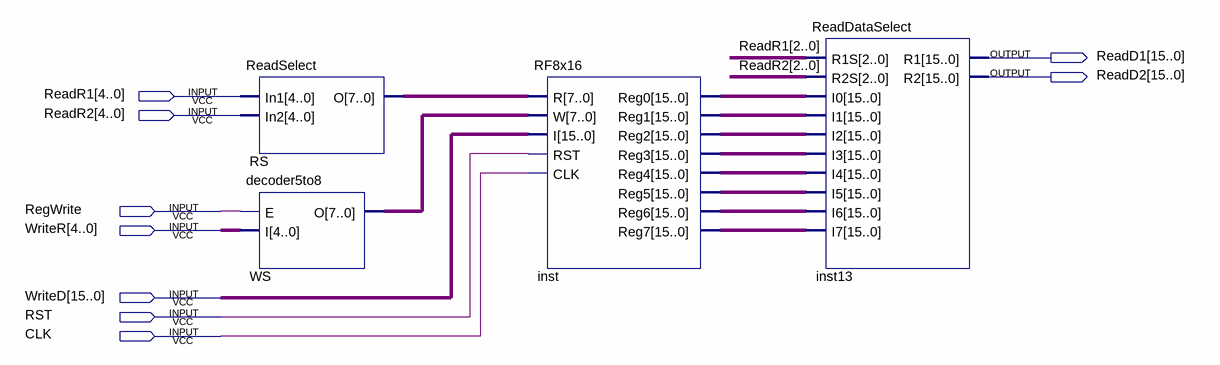
[diagram p0: schematic sheet]
// Quartus schematic Registers.bdf as structural Verilog: 4 symbols, 9 pins
module Registers (
  input  [4:0] ReadR1,
  input  [4:0] ReadR2,
  input  RegWrite,
  input  [4:0] WriteR,
  input  [15:0] WriteD,
  input  RST,
  input  CLK,
  output [15:0] ReadD1,
  output [15:0] ReadD2
);

  wire [7:0] RS_o, WS_o;
  wire [15:0] inst_reg0, inst_reg1, inst_reg2, inst_reg3, inst_reg4, inst_reg5, inst_reg6, inst_reg7;

  ReadSelect RS (.In1(ReadR1), .In2(ReadR2), .O(RS_o));
  decoder5to8 WS (.E(RegWrite), .I(WriteR), .O(WS_o));
  RF8x16 inst (
    .R(RS_o), .W(WS_o), .I(WriteD), .RST(RST), .CLK(CLK), .Reg0(inst_reg0), .Reg1(inst_reg1),
    .Reg2(inst_reg2), .Reg3(inst_reg3), .Reg4(inst_reg4), .Reg5(inst_reg5), .Reg6(inst_reg6), .Reg7(inst_reg7));
  ReadDataSelect inst13 (
    .R1S(ReadR1[2:0]), .I0(inst_reg0), .I1(inst_reg1), .I2(inst_reg2), .I3(inst_reg3), .I4(inst_reg4),
    .I5(inst_reg5), .I6(inst_reg6), .I7(inst_reg7), .R2S(ReadR2[2:0]), .R1(ReadD1), .R2(ReadD2));
endmodule
